# EAGLE design Vertical Breakout Module (EAGLE 6.3)
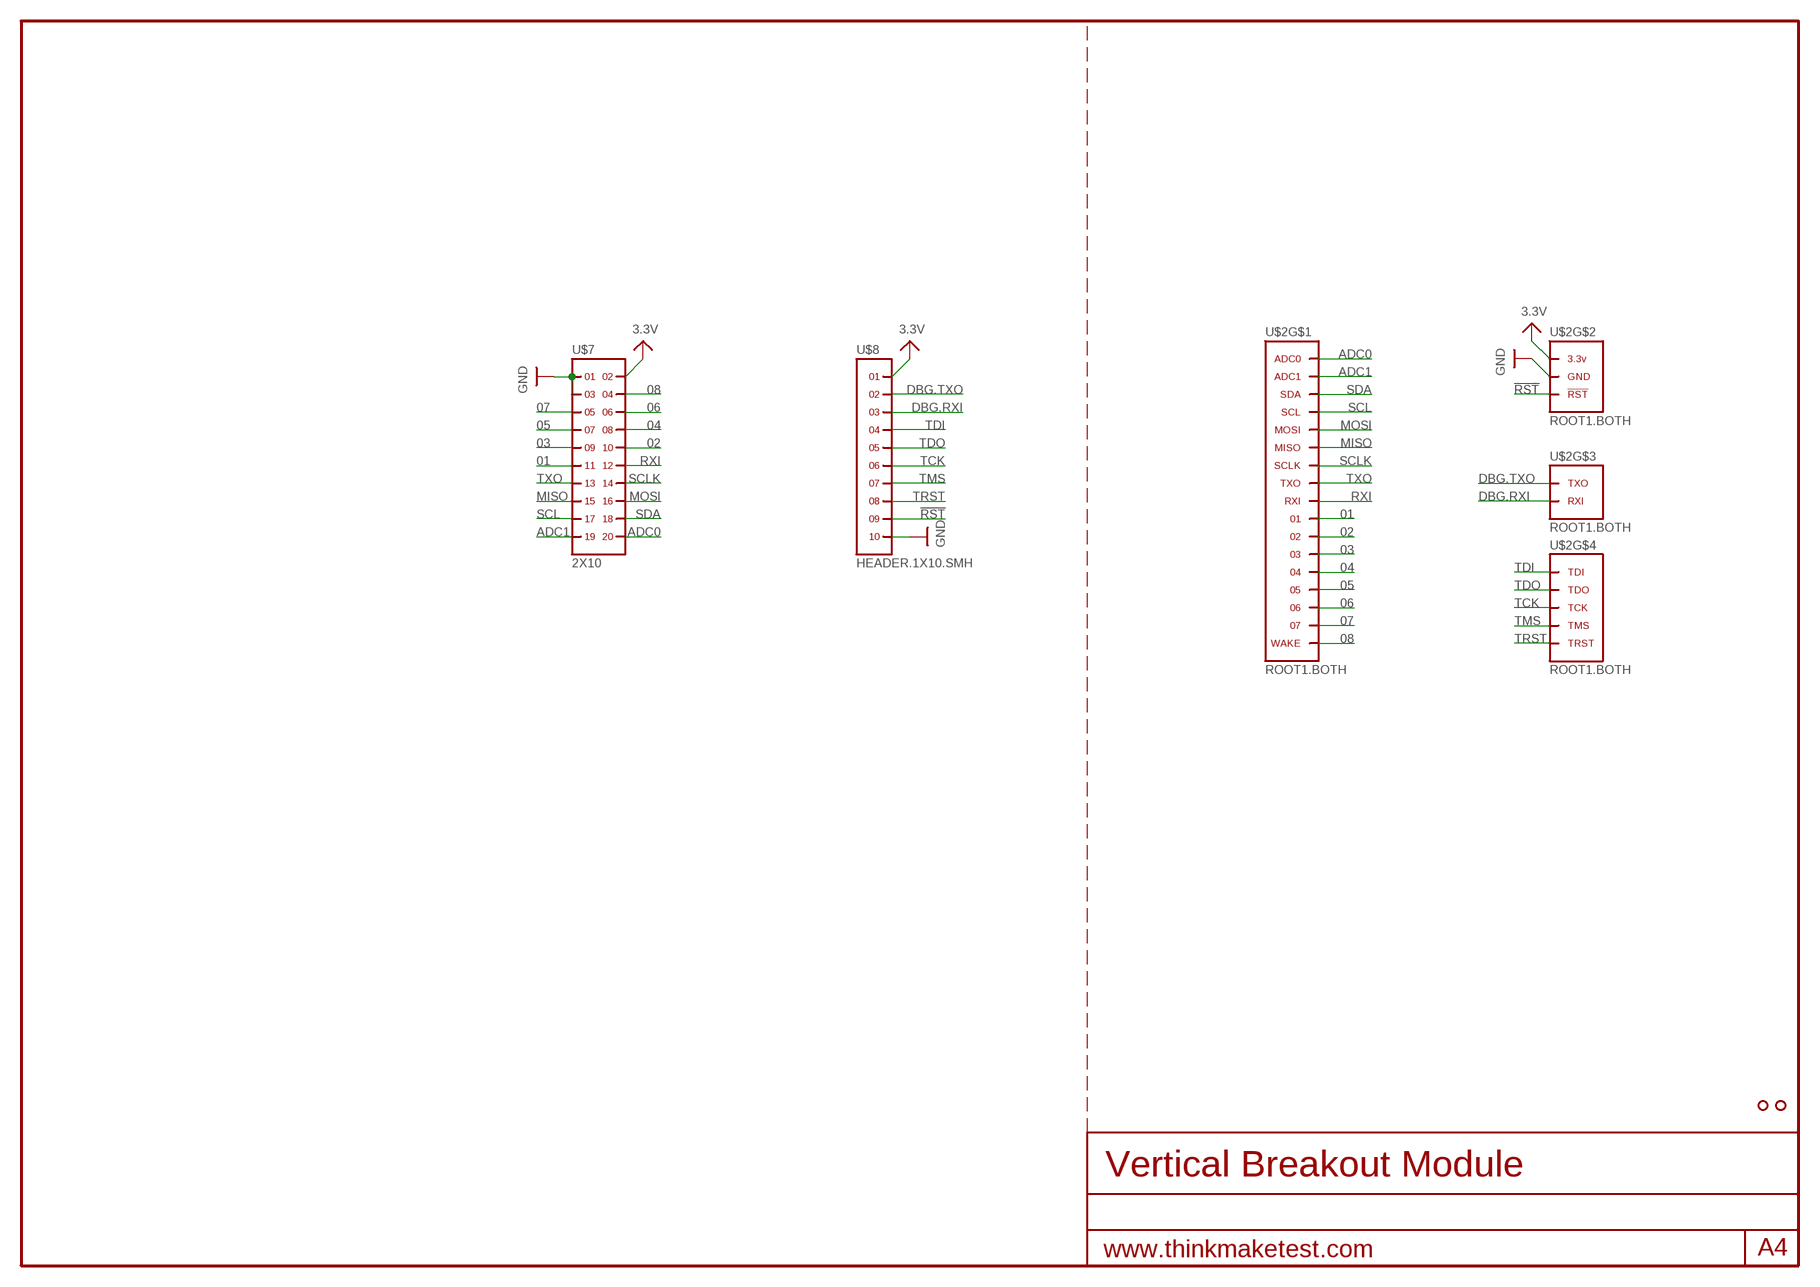
[diagram p0: schematic, sheet 1]

## Parts
U$2  ROOT1.BOTH  [ROOT1.BOTH]
U$3  HOLE.#2  [#2]
U$4  HOLE.#2  [#2]
U$7  2X10  [2X10]
U$8  HEADER.1X10.SMH  [SMH-110-XX-X-S]

## Nets
01: U$2.01 U$2.01@1 U$2.01@VIA U$7.11
02: U$2.02 U$2.02@1 U$2.02@VIA U$7.10
03: U$2.03 U$2.03@1 U$2.03@VIA U$7.9
3.3V: U$2.3.3V@1(3.3V) U$2.3.3V@2(3.3V) U$2.3.3V@3(3.3V) U$2.3.3V@4(3.3V) U$2.3.3V@5(3.3V) U$2.3.3V@6(3.3V) U$2.3.3V@7(3.3V) U$2.3.3V@8(3.3V) U$2.3.3V@9(3.3V) U$2.3.3V@10(3.3V) U$2.3.3V@11(3.3V) U$2.3.3V@12(3.3V) U$2.3.3V@13(3.3V) U$2.3.3V@14(3.3V) U$2.3.3V@15(3.3V) U$2.3.3V@16(3.3V) U$2.3.3V@17(3.3V) U$2.3.3V@18(3.3V) U$2.3.3V@19(3.3V) U$2.3.3V@20(3.3V) U$2.3.3V@21(3.3V) U$2.3.3V@22(3.3V) U$2.3.3V@23(3.3V) U$2.3.3V@24(3.3V) U$2.3.3V@VIA(3.3V) U$7.2 U$8.1
04: U$2.04 U$2.04@1 U$2.04@VIA U$7.8
05: U$2.05 U$2.05@1 U$2.05@VIA U$7.7
06: U$2.06 U$2.06@1 U$2.06@VIA U$7.6
07: U$2.07 U$2.07@1 U$2.07@VIA U$7.5
08: U$2.WAKE U$2.WAKE@1(WAKE) U$2.WAKE@VIA(WAKE) U$7.4
!RST: U$2.RST(!RST) U$2.RST@1(!RST) U$2.RST@VIA(!RST) U$8.9
ADC0: U$2.ADC0 U$2.ADC0@1(ADC0) U$2.ADC0@VIA(ADC0) U$7.20
ADC1: U$2.ADC1 U$2.ADC1@1(ADC1) U$2.ADC1@VIA(ADC1) U$7.19
DBG.RXI: U$2.RXI.DBG(RXI) U$2.RXI.DBG@1(RXI) U$2.RXI.DBG@VIA(RXI) U$8.3
DBG.TXO: U$2.TXO.DBG(TXO) U$2.TXO.DBG@1(TXO) U$2.TXO.DBG@VIA(TXO) U$8.2
GND: U$2.GND@1(GND) U$2.GND@2(GND) U$2.GND@3(GND) U$2.GND@4(GND) U$2.GND@5(GND) U$2.GND@6(GND) U$2.GND@7(GND) U$2.GND@8(GND) U$2.GND@9(GND) U$2.GND@10(GND) U$2.GND@11(GND) U$2.GND@12(GND) U$2.GND@13(GND) U$2.GND@14(GND) U$2.GND@15(GND) U$2.GND@16(GND) U$2.GND@17(GND) U$2.GND@18(GND) U$2.GND@19(GND) U$2.GND@20(GND) U$2.GND@21(GND) U$2.GND@22(GND) U$2.GND@23(GND) U$2.GND@24(GND) U$2.GND@25(GND) U$2.GND@26(GND) U$2.GND@VIA(GND) U$7.1 U$7.3 U$8.10
MISO: U$2.MISO U$2.MISO@1(MISO) U$2.MISO@VIA(MISO) U$7.15
MOSI: U$2.MOSI U$2.MOSI@1(MOSI) U$2.MOSI@VIA(MOSI) U$7.16
RXI: U$2.RXI U$2.RXI@1(RXI) U$2.RXI@VIA(RXI) U$7.12
SCL: U$2.SCL U$2.SCL@1(SCL) U$2.SCL@VIA(SCL) U$7.17
SCLK: U$2.SCLK U$2.SCLK@1(SCLK) U$2.SCLK@VIA(SCLK) U$7.14
SDA: U$2.SDA U$2.SDA@1(SDA) U$2.SDA@VIA(SDA) U$7.18
TCK: U$2.TCK U$2.TCK@1(TCK) U$2.TCK@VIA(TCK) U$8.6
TDI: U$2.TDI U$2.TDI@1(TDI) U$2.TDI@VIA(TDI) U$8.4
TDO: U$2.TDO U$2.TDO@1(TDO) U$2.TDO@VIA(TDO) U$8.5
TMS: U$2.TMS U$2.TMS@1(TMS) U$2.TMS@VIA(TMS) U$8.7
TRST: U$2.TRST U$2.TRST@1(TRST) U$2.TRST@VIA(TRST) U$8.8
TXO: U$2.TXO U$2.TXO@1(TXO) U$2.TXO@VIA(TXO) U$7.13

## Library data of the parts
U$2 = thinkmaketest:ROOT1
U$3 U$4 = .screw_holes:HOLE
U$7 = .headers(.1in):2X10
U$8 = samtec:HEADER.1X10

## Board
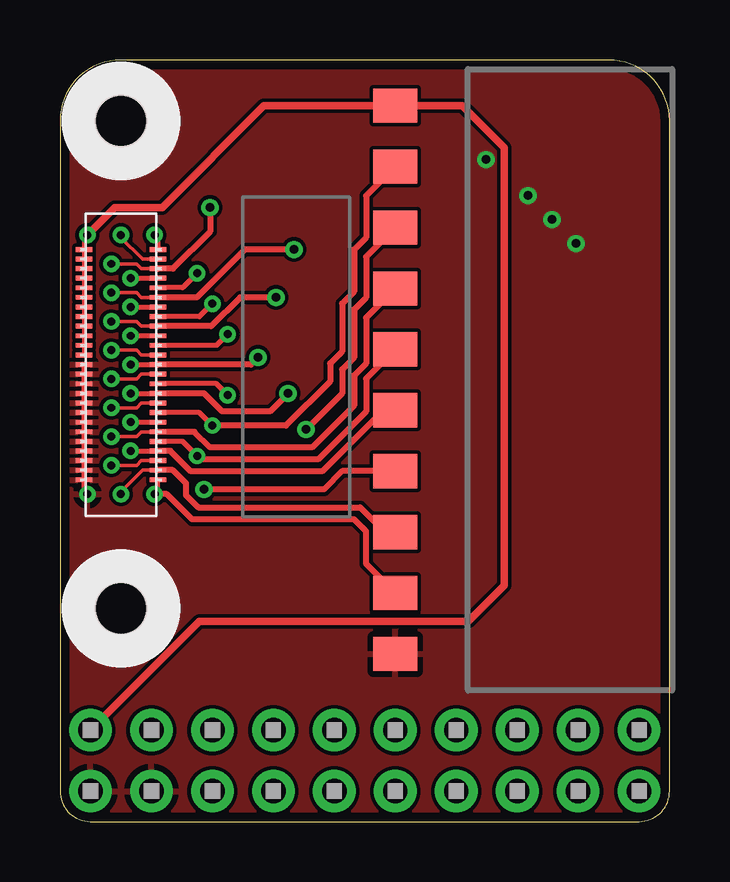
[diagram p1: board, top side]
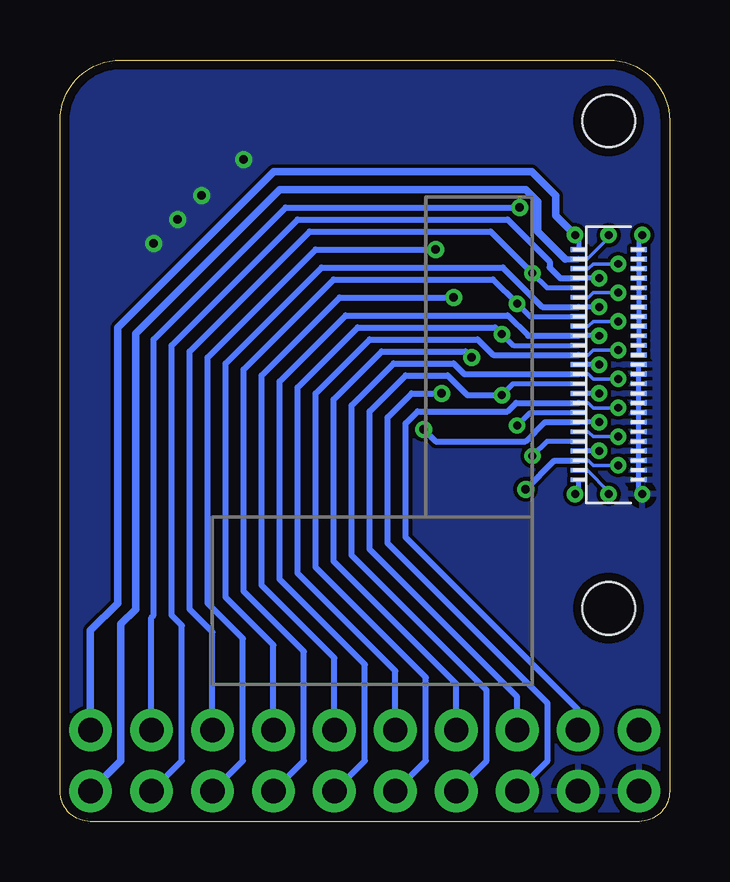
[diagram p2: board, bottom side, seen from below]

Size 25.4 x 31.75 mm. Coordinates in mm from the lower left corner, seen from the top.
Outline: 0,29.21 0,1.27 arc90 1.27,0 24.13,0 arc90 25.4,1.27 25.4,29.21 arc90 22.86,31.75 2.54,31.75 arc90 0,29.21
Copper layers (1*16): Top 0.0356mm / dielectric 1.5011mm / Bottom 0.0356mm
Design rules "default": minimum track width 6mil, minimum drill 13mil, track to track 6mil, track to pad 6mil, pad to pad 6mil, via to via 6mil, smd to smd 6mil, copper to edge 15mil, drill to drill 6mil, minimum pad ring 7mil, minimum via ring 7mil, stop-mask expansion 4mil, vias tented up to drill 16mil, thermal gap 10mil

### Footprints (pad centres in the part's own frame; a part is rotated, then mirrored left to right if it is on the bottom)
ROOT1.BOTH = smd 0.66 x 0.2 bottom: 01 3.795,13.9; 02 3.795,13.5; 03 3.795,13.1; 3.3V@1 1.285,17.5; 3.3V@2 1.285,17.1; 3.3V@3 1.285,16.7; 3.3V@4 1.285,16.3; 3.3V@5 1.285,15.9; 3.3V@6 1.285,15.5; 3.3V@7 1.285,15.1; 3.3V@8 1.285,14.7; 3.3V@9 1.285,14.3; 3.3V@10 1.285,13.9; 3.3V@11 1.285,13.5; 3.3V@12 1.285,13.1; 04 3.795,12.7; 05 3.795,12.3; 06 3.795,11.9; 07 3.795,11.5; ADC0 3.795,17.5; ADC1 3.795,17.1; GND@1 1.285,7.9; GND@2 1.285,8.3; GND@3 1.285,8.7; GND@4 1.285,9.1; GND@5 1.285,9.5; GND@6 1.285,9.9; GND@7 1.285,10.3; GND@8 1.285,10.7; GND@9 1.285,11.1; GND@10 1.285,11.5; GND@11 1.285,11.9; GND@12 1.285,12.3; GND@13 1.285,12.7; MISO 3.795,15.5; MOSI 3.795,15.9; RST 3.795,7.9; RXI 3.795,14.3; RXI.DBG 3.795,10.3; SCL 3.795,16.3; SCLK 3.795,15.1; SDA 3.795,16.7; TCK 3.795,9.1; TDI 3.795,9.9; TDO 3.795,9.5; TMS 3.795,8.7; TRST 3.795,8.3; TXO 3.795,14.7; TXO.DBG 3.795,10.7; WAKE 3.795,11.1 | smd 0.7 x 0.2: 01@1 4.08,13.9; 02@1 4.08,13.5; 3.3V@13 1,17.5; 3.3V@14 1,17.1; 3.3V@15 1,16.7; 3.3V@16 1,16.3; 3.3V@17 1,15.9; 3.3V@18 1,15.5; 3.3V@19 1,15.1; 3.3V@20 1,14.7; 3.3V@21 1,14.3; 3.3V@22 1,13.9; 3.3V@23 1,13.5; 3.3V@24 1,13.1; 03@1 4.08,13.1; 04@1 4.08,12.7; 05@1 4.08,12.3; 06@1 4.08,11.9; 07@1 4.08,11.5; ADC0@1 4.08,17.5; ADC1@1 4.08,17.1; GND@14 1,7.9; GND@15 1,8.3; GND@16 1,8.7; GND@17 1,9.1; GND@18 1,9.5; GND@19 1,9.9; GND@20 1,10.3; GND@21 1,10.7; GND@22 1,11.1; GND@23 1,11.5; GND@24 1,11.9; GND@25 1,12.3; GND@26 1,12.7; MISO@1 4.08,15.5; MOSI@1 4.08,15.9; RST@1 4.08,7.9; RXI.DBG@1 4.08,10.3; RXI@1 4.08,14.3; SCL@1 4.08,16.3; SCLK@1 4.08,15.1; SDA@1 4.08,16.7; TCK@1 4.08,9.1; TDI@1 4.08,9.9; TDO@1 4.08,9.5; TMS@1 4.08,8.7; TRST@1 4.08,8.3; TXO.DBG@1 4.08,10.7; TXO@1 4.08,14.7; WAKE@1 4.08,11.1 | drill 0.33 pad 0.686: 01@VIA 2.94,13.9; 02@VIA 6.985,13.97; 3.3V@VIA 1.14,18.1; 03@VIA 2.14,13.3; 04@VIA 2.94,12.7; 05@VIA 2.14,12.1; 06@VIA 6.985,11.43; 07@VIA 2.94,11.5; ADC0@VIA 3.94,18.1; ADC1@VIA 2.54,18.1; GND@VIA 1.14,7.3; MISO@VIA 2.14,15.7; MOSI@VIA 5.715,16.51; RST@VIA 3.94,7.3; RXI.DBG@VIA 2.94,10.3; RXI@VIA 2.14,14.5; SCL@VIA 2.94,16.3; SCLK@VIA 2.94,15.1; SDA@VIA 2.14,16.9; TCK@VIA 2.94,9.1; TDI@VIA 2.14,9.7; TDO@VIA 5.715,8.89; TMS@VIA 2.14,8.5; TRST@VIA 2.54,7.3; TXO.DBG@VIA 6.35,10.16; TXO@VIA 6.35,15.24; WAKE@VIA 2.14,10.9
#2 = hole 2.184: 0,0
2X10 = drill 1.016 pad 1.778: 1 0,0; 2 0,2.54; 3 2.54,0; 4 2.54,2.54; 5 5.08,0; 6 5.08,2.54; 7 7.62,0; 8 7.62,2.54; 9 10.16,0; 10 10.16,2.54; 11 12.7,0; 12 12.7,2.54; 13 15.24,0; 14 15.24,2.54; 15 17.78,0; 16 17.78,2.54; 17 20.32,0; 18 20.32,2.54; 19 22.86,0; 20 22.86,2.54
SMH-110-XX-X-S = smd 1.422 x 1.829: 1 -11.43,0; 2 -8.89,0; 3 -6.35,0; 4 -3.81,0; 5 -1.27,0; 6 1.27,0; 7 3.81,0; 8 6.35,0; 9 8.89,0; 10 11.43,0

### Placement (x,y rotation side)
U$2  0,6.35 0 top
U$3  2.54,8.89 90 top
U$4  2.54,29.21 90 top
U$7  1.27,1.27 0 top
U$8  13.97,18.41 270 top

### Tracks (layer width: path | path; a pad name or v marks a point on that pad's centre or on a via)
01
  Bottom 0.254: U$7.11 12.7,2.54 12.7,6.55 16.25,10.1 16.25,18.35 13.5,21.1 6.75,21.1 5.9,20.25 U$2.01
02
  Bottom 0.254: U$7.10 11.43,6.28 15.5,10.35 15.5,18.1 13,20.6 7.26,20.6 U$2.02@VIA
03
  Bottom 0.254: U$7.9 10.16,2.54 10.16,6.01 14.75,10.6 14.75,17.85 12.5,20.1 8,20.1 7.35,19.45 U$2.03
3.3V
  Top 0.305: U$2.3.3V@VIA 2.29,25.6 4.25,25.6 8.49,29.84 U$8.1 16.75,29.84 18.5,28.1 18.5,9.85 17,8.35 5.81,8.35 U$7.2
04  (via drill 0.36)
  Top 0.254: v8.25,19.35 7.95,19.05 U$2.04@1
  Bottom 0.254: U$7.8 8.89,5.74 14,10.85 14,17.6 12,19.6 8.5,19.6 v8.25,19.35
05
  Bottom 0.254: U$7.7 7.62,2.54 7.62,5.47 13.25,11.1 13.25,17.35 11.5,19.1 9,19.1 8.55,18.65 U$2.05
06
  Bottom 0.254: U$7.6 6.35,5.2 12.5,11.35 12.5,17.1 11,18.6 9.25,18.6 8.43,17.78 U$2.06@VIA
07  (via drill 0.36)
  Top 0.254: v9.5,17.85 8.75,17.1 6.75,17.1 6,17.85 U$2.07@1
  Bottom 0.254: U$7.5 5.08,2.54 5.08,4.93 11.75,11.6 11.75,16.85 10.75,17.85 v9.5,17.85
08
  Bottom 0.254: U$7.4 3.81,4.66 11,11.85 11,16.6 10.5,17.1 6.75,17.1 6.4,17.45 U$2.WAKE
!RST
  Top 0.254: U$8.9 12.75,10.74 12.75,12.1 12.25,12.6 5.5,12.6 4.45,13.65 U$2.RST@VIA
ADC0
  Bottom 0.305: U$7.20 24.13,7.97 23,9.1 23,20.6 16.5,27.1 5.75,27.1 4.75,26.1 4.75,25.26 U$2.ADC0@VIA
ADC1
  Bottom 0.254: 4.35,23.45 U$2.ADC1
  Bottom 0.305: U$7.19 22.86,2.54 22.86,8.24 22.25,8.85 22.25,20.35 16.25,26.35 6,26.35 5.5,25.85 5.5,24.6 4.35,23.45
DBG.RXI  (via drill 0.36)
  Top 0.254: U$8.3 12.75,23.55 12.75,21.85 12.25,21.35 12.25,19.35 11.75,18.85 11.75,17.85 v10.25,16.35
  Bottom 0.254: v10.25,16.35 9.75,15.85 6,15.85 5.2,16.65 U$2.RXI.DBG
DBG.TXO
  Top 0.254: U$8.2 12.75,26.09 12.75,24.35 12.25,23.85 12.25,22.1 11.75,21.6 11.75,19.6 11.25,19.1 11.25,18.35 9.41,16.51 U$2.TXO.DBG@VIA
GND  (via drill 0.36)
  other vias: 17.75,27.6 19.5,26.1 20.5,25.1 21.5,24.1
  pour Bottom (rank 6): 0,0 25.4,0 25.4,31.75 0,31.75
  pour Top (rank 6): 0,0 25.4,0 25.4,31.75 0,31.75
MISO  (via drill 0.36)
  Top 0.254: v9.75,23.85 7.7,23.85 5.7,21.85 U$2.MISO@1
  Bottom 0.254: U$7.15 17.78,2.54 17.78,7.63 19.25,9.1 19.25,19.35 14.75,23.85 v9.75,23.85
MOSI
  Bottom 0.254: U$7.16 19.05,7.9 20,8.85 20,19.6 15,24.6 7.46,24.6 U$2.MOSI@VIA
RXI  (via drill 0.36)
  Top 0.254: v9,21.85 7.5,21.85 6.3,20.65 U$2.RXI@1
  Bottom 0.254: U$7.12 13.97,6.82 17,9.85 17,18.6 13.75,21.85 v9,21.85
SCL
  Bottom 0.254: U$7.17 20.32,2.54 20.32,8.17 20.75,8.6 20.75,19.85 15.5,25.1 6.75,25.1 5,23.35 5,23.1 4.55,22.65 U$2.SCL
SCLK
  Bottom 0.254: U$7.14 16.51,7.36 18.5,9.35 18.5,19.1 14.5,23.1 6.95,23.1 5.3,21.45 U$2.SCLK
SDA  (via drill 0.36)
  Top 0.254: v6.25,25.6 6.25,24.6 4.7,23.05 U$2.SDA@1
  Bottom 0.254: U$7.18 21.59,8.51 21.5,8.6 21.5,20.1 16,25.6 v6.25,25.6
TCK
  Top 0.254: U$2.TCK@1 4.6,15.45 5.45,14.6 10.93,14.6 13.47,17.14 U$8.6
TDI
  Top 0.254: U$8.4 12.75,21 12.75,19.1 12.25,18.6 12.25,17.35 10.5,15.6 6.25,15.6 5.6,16.25 U$2.TDI@1
TDO
  Top 0.254: U$8.5 12.75,18.46 12.75,17.1 10.75,15.1 5.86,15.1 U$2.TDO@VIA
TMS  (via drill 0.36)
  Top 0.254: U$8.7 11.76,14.61 11,13.85 v6,13.85
  Bottom 0.254: v6,13.85 4.8,15.05 U$2.TMS
TRST
  Top 0.254: U$2.TRST@1 4.7,14.65 5.25,14.1 5.25,13.6 5.75,13.1 12.5,13.1 13.54,12.06 U$8.8
TXO
  Bottom 0.254: U$7.13 15.24,2.54 15.24,7.09 17.75,9.6 17.75,18.85 14,22.6 7.36,22.6 U$2.TXO@VIA

### Text on the board
tDocu: 3.3v | D.TXO | D.RXI | TDI | TDO | TCK | TMS | TRST | !RST | GND
bDocu: 3.3v | D.TXO | D.RXI | TDI | TDO | TCK | TMS | TRST | !RST | Cruz Monrreal II | GND | AnomalousMaker.com | v1 | 3.3v | GND | 08 | GND | 06 | 07 | 04 | 05 | 02 | 03 | 01 | RXI | SCLK | TXO | MISO | MOSI | SCL | SDA | ADC0 | ADC1